# EAGLE design Schematic_v1.1 (EAGLE 6.2)
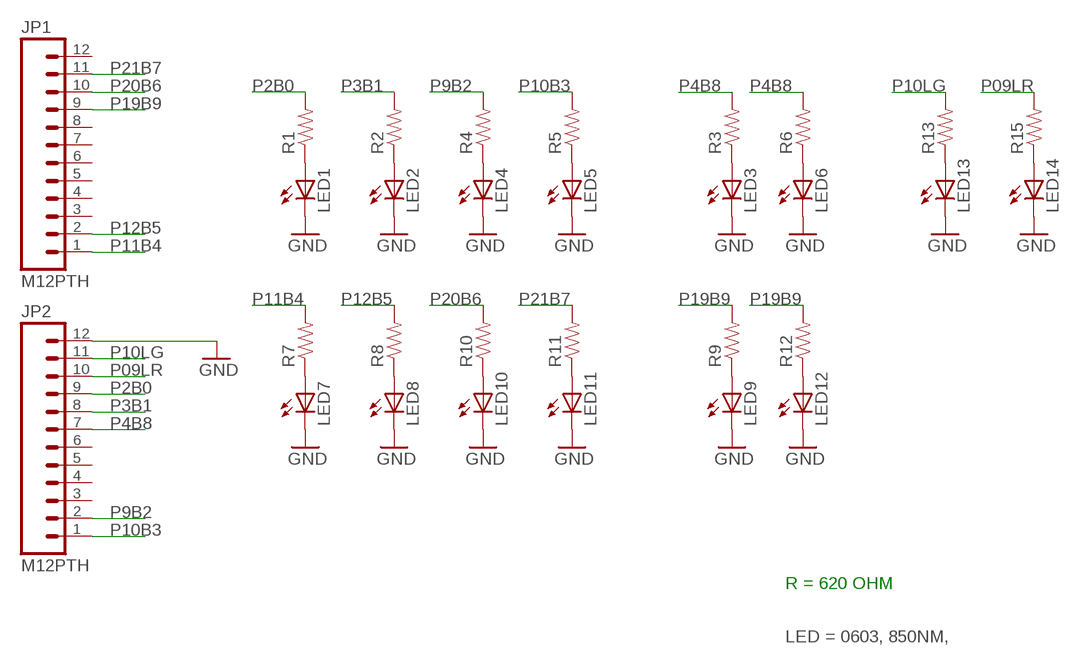
[diagram p0: schematic, sheet 1]

## Parts
JP1  M12PTH  [1X12]
JP2  M12PTH  [1X12]
LED1  LEDCHIPLED_0603  [CHIPLED_0603]
LED2  LEDCHIPLED_0603  [CHIPLED_0603]
LED3  LEDCHIPLED_0603  [CHIPLED_0603]
LED4  LEDCHIPLED_0603  [CHIPLED_0603]
LED5  LEDCHIPLED_0603  [CHIPLED_0603]
LED6  LEDCHIPLED_0603  [CHIPLED_0603]
LED7  LEDCHIPLED_0603  [CHIPLED_0603]
LED8  LEDCHIPLED_0603  [CHIPLED_0603]
LED9  LEDCHIPLED_0603  [CHIPLED_0603]
LED10  LEDCHIPLED_0603  [CHIPLED_0603]
LED11  LEDCHIPLED_0603  [CHIPLED_0603]
LED12  LEDCHIPLED_0603  [CHIPLED_0603]
LED13  LEDCHIPLED_0603  [CHIPLED_0603]
LED14  LEDCHIPLED_0603  [CHIPLED_0603]
R1  RESISTOR0603-RES  [0603-RES]
R2  RESISTOR0603-RES  [0603-RES]
R3  RESISTOR0603-RES  [0603-RES]
R4  RESISTOR0603-RES  [0603-RES]
R5  RESISTOR0603-RES  [0603-RES]
R6  RESISTOR0603-RES  [0603-RES]
R7  RESISTOR0603-RES  [0603-RES]
R8  RESISTOR0603-RES  [0603-RES]
R9  RESISTOR0603-RES  [0603-RES]
R10  RESISTOR0603-RES  [0603-RES]
R11  RESISTOR0603-RES  [0603-RES]
R12  RESISTOR0603-RES  [0603-RES]
R13  RESISTOR0603-RES  [0603-RES]
R15  RESISTOR0603-RES  [0603-RES]

## Nets
GND: JP2.12 LED1.C LED2.C LED3.C LED4.C LED5.C LED6.C LED7.C LED8.C LED9.C LED10.C LED11.C LED12.C LED13.C LED14.C
N$1: LED13.A R13.1
N$2: LED7.A R7.1
N$3: LED3.A R3.1
N$4: LED4.A R4.1
N$5: LED5.A R5.1
N$6: LED6.A R6.1
N$7: LED2.A R2.1
N$8: LED8.A R8.1
N$9: LED9.A R9.1
N$10: LED10.A R10.1
N$11: LED11.A R11.1
N$12: LED12.A R12.1
N$13: LED1.A R1.1
N$18: LED14.A R15.1
P2B0: JP2.9 R1.2
P3B1: JP2.8 R2.2
P4B8: JP2.7 R3.2 R6.2
P9B2: JP2.2 R4.2
P09LR: JP2.10 R15.2
P10B3: JP2.1 R5.2
P10LG: JP2.11 R13.2
P11B4: JP1.1 R7.2
P12B5: JP1.2 R8.2
P19B9: JP1.9 R9.2 R12.2
P20B6: JP1.10 R10.2
P21B7: JP1.11 R11.2
Unconnected: JP1.3 JP1.4 JP1.5 JP1.6 JP1.7 JP1.8 JP1.12 JP2.3 JP2.4 JP2.5 JP2.6

## Notes on the sheet
- R = 620 OHM
- LED = 0603, 850NM,

## Library data of the parts
JP1 JP2 = SparkFun-Connectors:M12: Header 12 Standard 12-pin 0.1" header. Use with straight break away headers (SKU : PRT-00116), right angle break away headers (PRT-00553), swiss pins (PRT-00743), machine pins (PRT-00117), and female headers (PRT-00115).
LED1-LED14 = adafruit:LED: LED OSRAM: - CHIPLED LG R971, LG N971, LY N971, LG Q971, LY Q971, LO R971, LY R971 LH N974, LH R974 LS Q976, LO Q976, LY Q976 LO Q996 - Hyper CHIPLED LW Q18S LB Q993, LB Q99A, LB R99A - SideLED LS A670, LO A670, LY A670, LG A670, LP A670 LB A673, LV A673, LT A673, LW A673 LH A674 LY A675 LS A676, LA A676, LO A676, LY A676, LW A676 LS A679, LY A679, LG A679 - Hyper Micro SIDELED® LS Y876, LA Y876, LO Y876, LY Y876 LT Y87S - SmartLED LW L88C, LW L88S LB L89C, LB L89S, LG L890 LS L89K, LO L89K, LY L89K LS L896, LA L896, LO L896, LY L896 - TOPLED LS T670, LO T670, LY T670, LG T670, LP T670 LSG T670, LSP T670, LSY T670, LOP T670, LYG T670 LG T671, LOG T671, LSG T671 LB T673, LV T673, LT T673, LW T673 LH T674 LS T676, LA T676, LO T676, LY T676, LB T676, LH T676, LSB T676, LW T676 LB T67C, LV T67C, LT T67C, LS T67K, LO T67K, LY T67K, LW E67C LS E67B, LA E67B, LO E67B, LY E67B, LB E67C, LV E67C, LT E67C LW T67C LS T679, LY T679, LG T679 LS T770, LO T770, LY T770, LG T770, LP T770 LB T773, LV T773, LT T773, LW T773 LH T774 LS E675, LA E675, LY E675, LS T675 LS T776, LA T776, LO T776, LY T776, LB T776 LHGB T686 LT T68C, LB T68C - Hyper Mini TOPLED® LB M676 - Mini TOPLED Santana® LG M470 LS M47K, LO M47K, LY M47K Source: http://www.osram.convergy.de/
R1-R13 R15 = SparkFun-Passives:RESISTOR: Resistor Basic schematic elements and footprints for 0603, 1206, and PTH resistors.

## Board
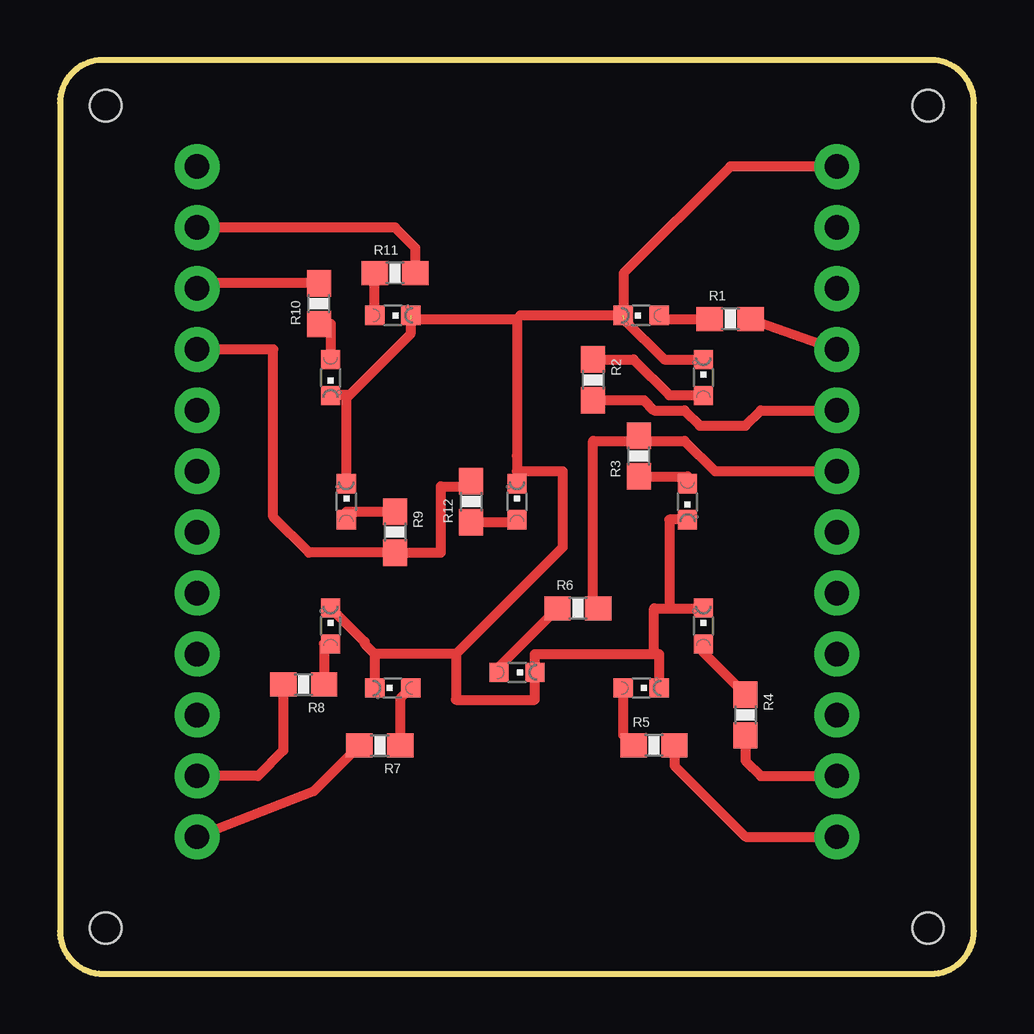
[diagram p1: board, top side]
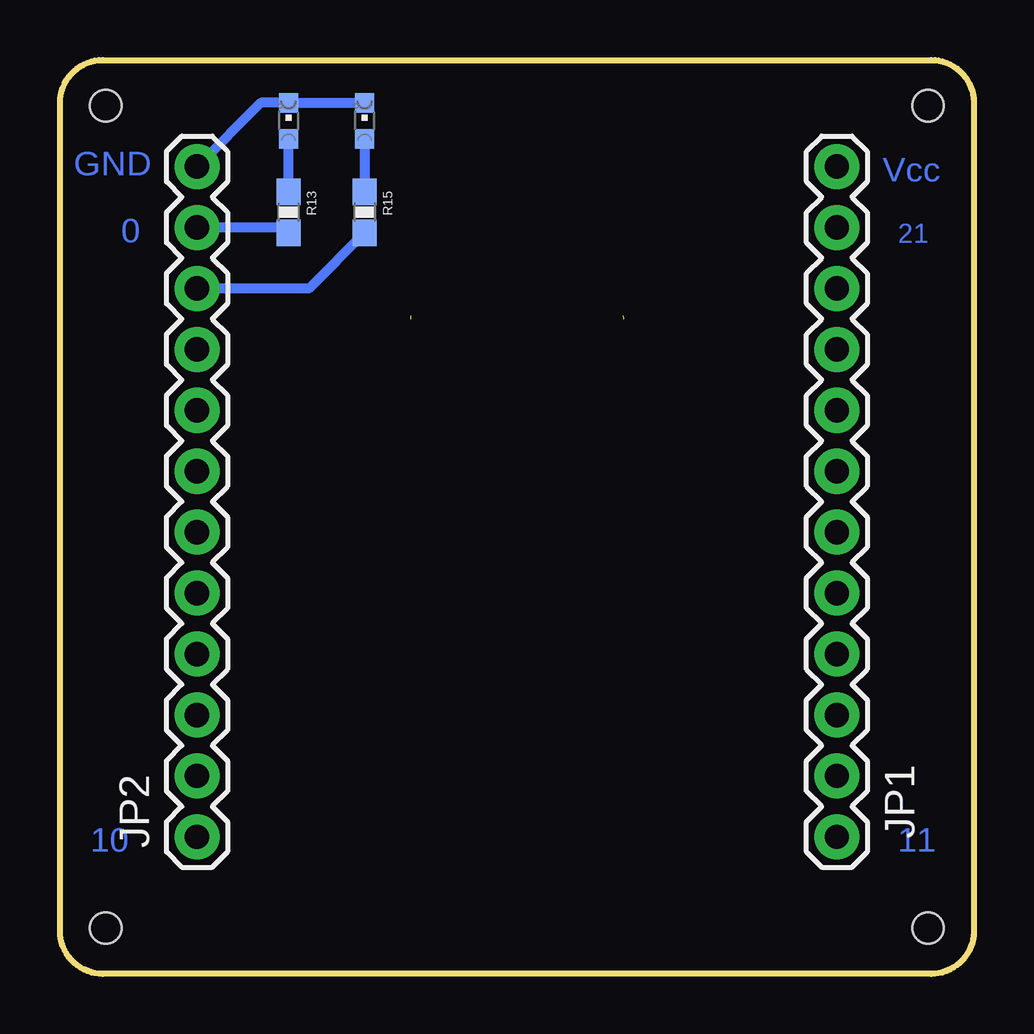
[diagram p2: board, bottom side, seen from below]

Size 38.1 x 38.1 mm. Coordinates in mm from the lower left corner, seen from the top.
Outline: 0,36.3 0,1.8 arc90 1.8,0 36.3,0 arc90 38.1,1.8 38.1,36.3 arc90 36.3,38.1 1.8,38.1 arc90 0,36.3
Copper layers (1*16): Top 0.035mm / dielectric 1.5mm / Bottom 0.035mm
Design rules: minimum track width 6mil, minimum drill 24mil, track to track 8mil, track to pad 8mil, pad to pad 8mil, via to via 8mil, smd to smd 8mil, copper to edge 40mil, drill to drill 8mil, minimum pad ring 10mil, minimum via ring 8mil, stop-mask expansion 4mil, vias tented up to drill 0mil, thermal gap 10mil
Holes 1.3 mm at 1.91,36.2 36.2,36.2 36.2,1.91 1.91,1.91

### Footprints (pad centres in the part's own frame; a part is rotated, then mirrored left to right if it is on the bottom)
1X12 = drill 1.016 pad 1.88: 1 0,0; 2 2.54,0; 3 5.08,0; 4 7.62,0; 5 10.16,0; 6 12.7,0; 7 15.24,0; 8 17.78,0; 9 20.32,0; 10 22.86,0; 11 25.4,0; 12 27.94,0
CHIPLED_0603 = smd 0.8 x 0.8: A 0,-0.75; C 0,0.75
0603-RES = smd 1.1 x 1: 1 -0.85,0; 2 0.85,0

### Placement (x,y rotation side)
JP1  5.71,5.71 90 bottom
JP2  32.38,5.71 90 bottom
LED1  24.23,27.45 90 top
LED2  26.82,24.86 0 top
LED3  26.16,19.68 180 top
LED4  26.82,14.51 0 top
LED5  24.23,11.92 270 top
LED6  19.05,12.57 270 top
LED7  13.87,11.92 90 top
LED8  11.28,14.51 0 top
LED9  11.94,19.68 0 top
LED10  11.28,24.86 180 top
LED11  13.87,27.45 270 top
LED12  19.05,19.68 0 top
LED13  28.57,35.56 0 bottom
LED14  25.4,35.56 0 bottom
R1  27.94,27.3 0 top
R2  22.23,24.77 270 top
R3  24.13,21.59 90 top
R4  28.57,10.79 270 top
R5  24.77,9.53 0 top
R6  21.59,15.24 0 top
R7  13.34,9.53 180 top
R8  10.16,12.06 180 top
R9  13.97,18.41 270 top
R10  10.79,27.94 90 top
R11  13.97,29.21 0 top
R12  17.14,19.68 90 top
R13  28.57,31.75 270 bottom
R15  25.4,31.75 270 bottom

### Tracks (layer width: path | path; a pad name or v marks a point on that pad's centre or on a via)
GND  (2 unrouted)
  Top 0.152: 19.05,21.59 LED12.C 19.05,20.32
  Top 0.406: 19.05,27.3 14.61,27.3 14.61,26.67 12.06,24.13 | 19.05,27.3 19.05,21.59 19.05,20.95 20.95,20.95 20.95,17.78 16.51,13.34 | 24.77,13.34 19.8,13.34 LED6.C 19.8,11.43 16.51,11.43 16.51,13.34 | 16.51,13.34 13.12,13.34 | 13.12,13.34 LED7.C | LED5.C 24.98,13.34 24.77,13.34 | 24.77,13.34 24.77,15.24 25.4,15.24 | 25.4,15.24 26.82,15.24 LED4.C | LED3.C 25.4,18.93 25.4,15.24 | 12.06,24.13 11.3,24.13 LED10.C | LED9.C 11.94,24 12.06,24.13 | LED2.C 25.19,25.61 23.5,27.3 23.5,29.21 27.94,33.66 JP2.12 | 13.12,13.34 12.7,13.76 12.7,13.84 LED8.C | LED1.C 19.2,27.45 19.05,27.3
  Bottom 0.406: LED14.C LED13.C 29.73,36.31 JP2.12
N$1
  Bottom 0.406: R13.1 LED13.A
N$2
  Top 0.406: LED7.A 14.19,11.48 R7.1
N$3
  Top 0.406: R3.1 26.16,20.74 LED3.A
N$4
  Top 0.406: LED4.A 26.82,13.4 R4.1
N$5
  Top 0.406: LED5.A 23.48,9.96 R5.1
N$6
  Top 0.406: LED6.A 18.3,12.8 R6.1
N$7
  Top 0.406: R2.1 23.91,25.61 25.4,24.13 26.8,24.13 LED2.A
N$8
  Top 0.406: LED8.A 11.01,13.76 R8.1
N$9
  Top 0.406: R9.1 11.94,19.27 LED9.A
N$10
  Top 0.406: R10.1 11.28,27.09 LED10.A
N$11
  Top 0.406: LED11.A R11.1
N$12
  Top 0.406: R12.1 19.05,18.84 LED12.A
N$13
  Top 0.406: LED1.A 25.12,27.3 R1.1
N$18
  Bottom 0.406: LED14.A R15.1
P2B0
  Top 0.406: R1.2 JP2.9
P3B1
  Top 0.406: R2.2 24.34,23.91 24.77,23.5 26.04,23.5 26.67,22.86 28.57,22.86 29.21,23.5 JP2.8
P4B8
  Top 0.406: R6.2 22.23,15.24 22.23,22.23 24.13,22.23 | 24.13,22.23 R3.2 | 24.13,22.23 26.04,22.23 27.3,20.95 JP2.7
P9B2
  Top 0.406: R4.2 28.57,8.89 29.21,8.26 JP2.2
P09LR
  Bottom 0.406: R15.2 27.73,28.57 JP2.10
P10B3
  Top 0.406: R5.2 25.61,8.68 28.57,5.71 JP2.1
P10LG
  Bottom 0.406: R13.2 28.79,31.11 JP2.11
P11B4
  Top 0.406: R7.2 10.58,7.62 JP1.1
P12B5
  Top 0.406: R8.2 9.31,9.31 8.26,8.26 JP1.2
P19B9
  Top 0.406: R12.2 17.14,20.32 15.88,20.32 15.88,17.57 R9.2 10.38,17.57 8.89,19.05 8.89,26.04 JP1.9
P20B6
  Top 0.406: R10.2 5.93,28.79 JP1.10
P21B7
  Top 0.406: R11.2 14.82,30.27 13.97,31.11 JP1.11

### Text on the board
Bottom: GND | Vcc | 21 | 0 | 11 | 10